# EAGLE design waveshaper (EAGLE 9.6.2)
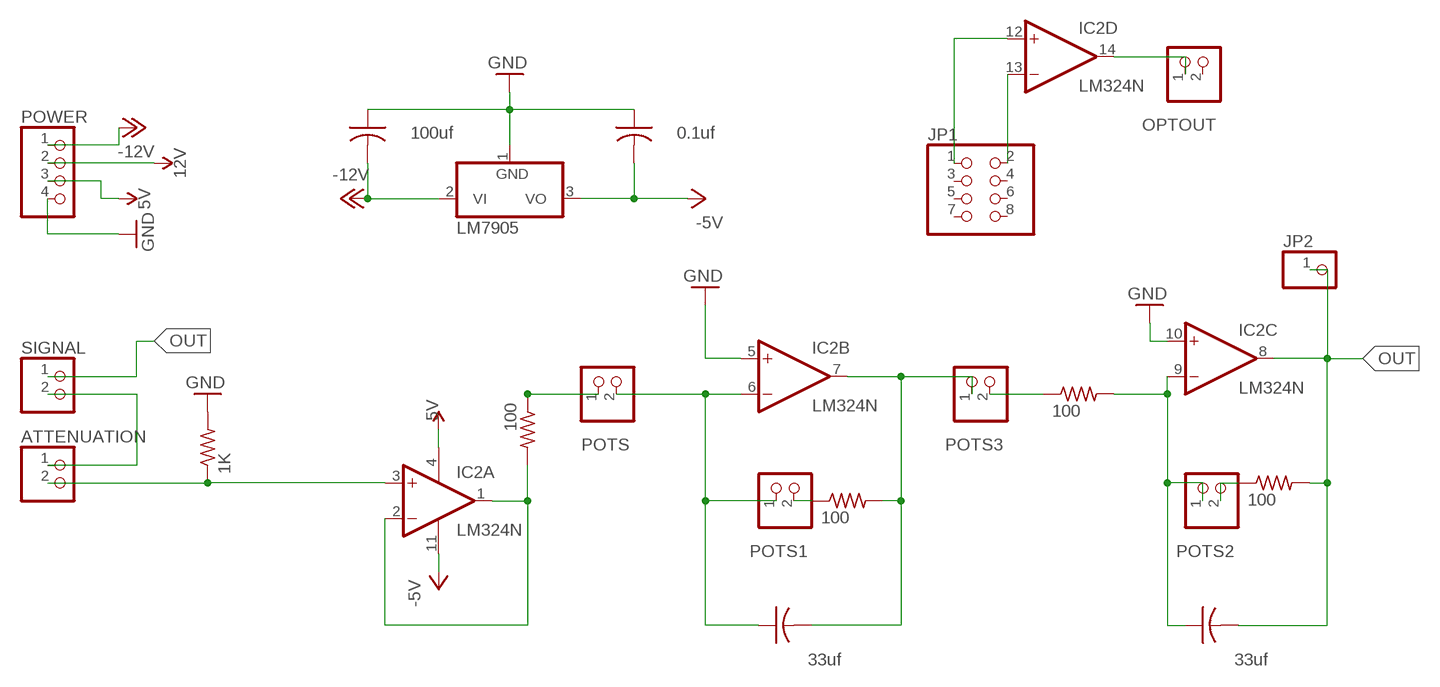
[diagram p0: schematic, sheet 1]

## Parts
ATTENUATION  PINHD-1X2  [1X02]
C1  100uf  C-US025-024X044  [C025-024X044]
C2  0.1uf  C-US025-024X044  [C025-024X044]
C3  33uf  C-US025-024X044  [C025-024X044]
C4  33uf  C-US025-024X044  [C025-024X044]
IC2  LM324N  [DIL14]
JP1  PINHD-2X4  [2X04]
JP2  PINHD-1X1  [1X01]
LM7905  7905T  [TO220H]
OPTOUT  PINHD-1X2  [1X02]
POTS  PINHD-1X2  [1X02]
POTS1  PINHD-1X2  [1X02]
POTS2  PINHD-1X2  [1X02]
POTS3  PINHD-1X2  [1X02]
POWER  PINHD-1X4  [1X04]
R1  1K  R-US_0207/12  [0207/12]
R2  100  R-US_0207/12  [0207/12]
R3  100  R-US_0207/12  [0207/12]
R4  100  R-US_0207/12  [0207/12]
R5  100  R-US_0207/12  [0207/12]
SIGNAL  PINHD-1X2  [1X02]

## Nets
5V: IC2.4(P:V+) POWER.3
12V: POWER.2
-5V: C2.2 IC2.11(P:V-) LM7905.3(VO)
-12V: C1.2 LM7905.2(VI) POWER.1
GND: C1.1 C2.1 IC2.5(B:+IN) IC2.10(C:+IN) LM7905.1(GND) POWER.4 R1.2
IN: ATTENUATION.2 IC2.3(A:+IN) R1.1
N$1: ATTENUATION.1 SIGNAL.2
N$2: C3.1 IC2.6(B:-IN) POTS1.1 POTS.2
N$3: C3.2 IC2.7(B:OUT) POTS3.1 R3.2
N$4: C4.1 IC2.9(C:-IN) POTS2.1 R5.2
N$5: IC2.14(D:OUT) OPTOUT.1
N$6: IC2.13(D:-IN) JP1.2
N$7: IC2.12(D:+IN) JP1.1
N$8: IC2.1(A:OUT) IC2.2(A:-IN) R2.2
N$9: POTS.1 R2.1
N$10: POTS1.2 R3.1
N$11: POTS2.2 R4.1
N$12: POTS3.2 R5.1
OUT: C4.2 IC2.8(C:OUT) JP2.1 R4.2 SIGNAL.1
Unconnected: JP1.3 JP1.4 JP1.5 JP1.6 JP1.7 JP1.8 OPTOUT.2

## Library data of the parts
ATTENUATION OPTOUT POTS POTS1-POTS3 SIGNAL = pinhead:PINHD-1X2: PIN HEADER
C1-C4 = adafruit:C-US: CAPACITOR, American symbol
IC2 = linear:LM324: OP AMP
JP1 = pinhead:PINHD-2X4: PIN HEADER
JP2 = pinhead:PINHD-1X1: PIN HEADER
LM7905 = linear:79*: Negative VOLTAGE REGULATOR
POWER = pinhead:PINHD-1X4: PIN HEADER
R1-R5 = adafruit:R-US_: RESISTOR, American symbol

## Board
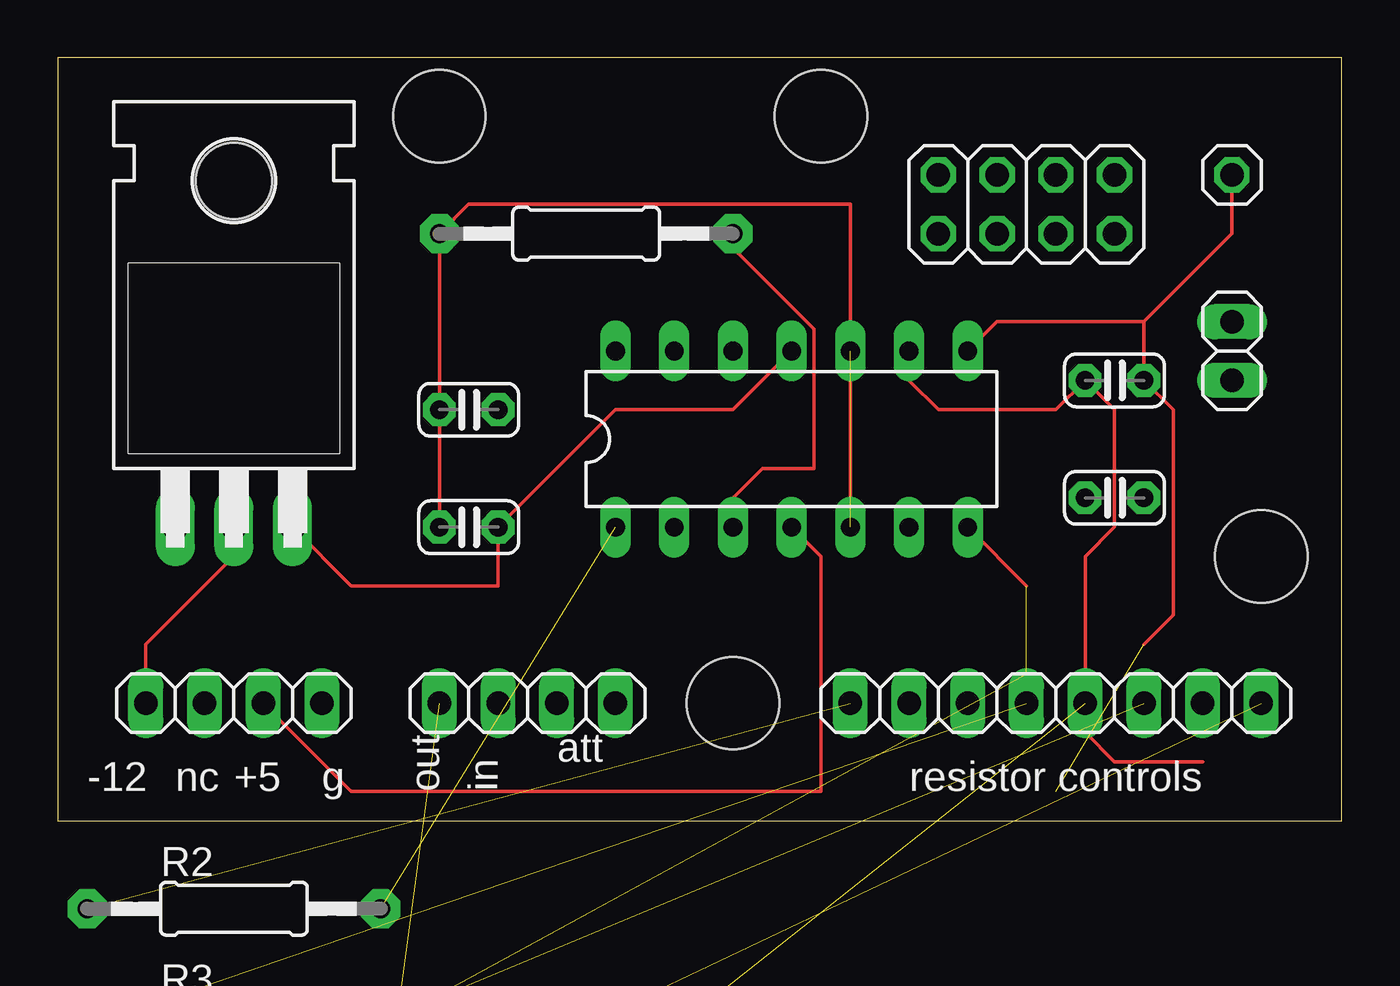
[diagram p1: board, top side]
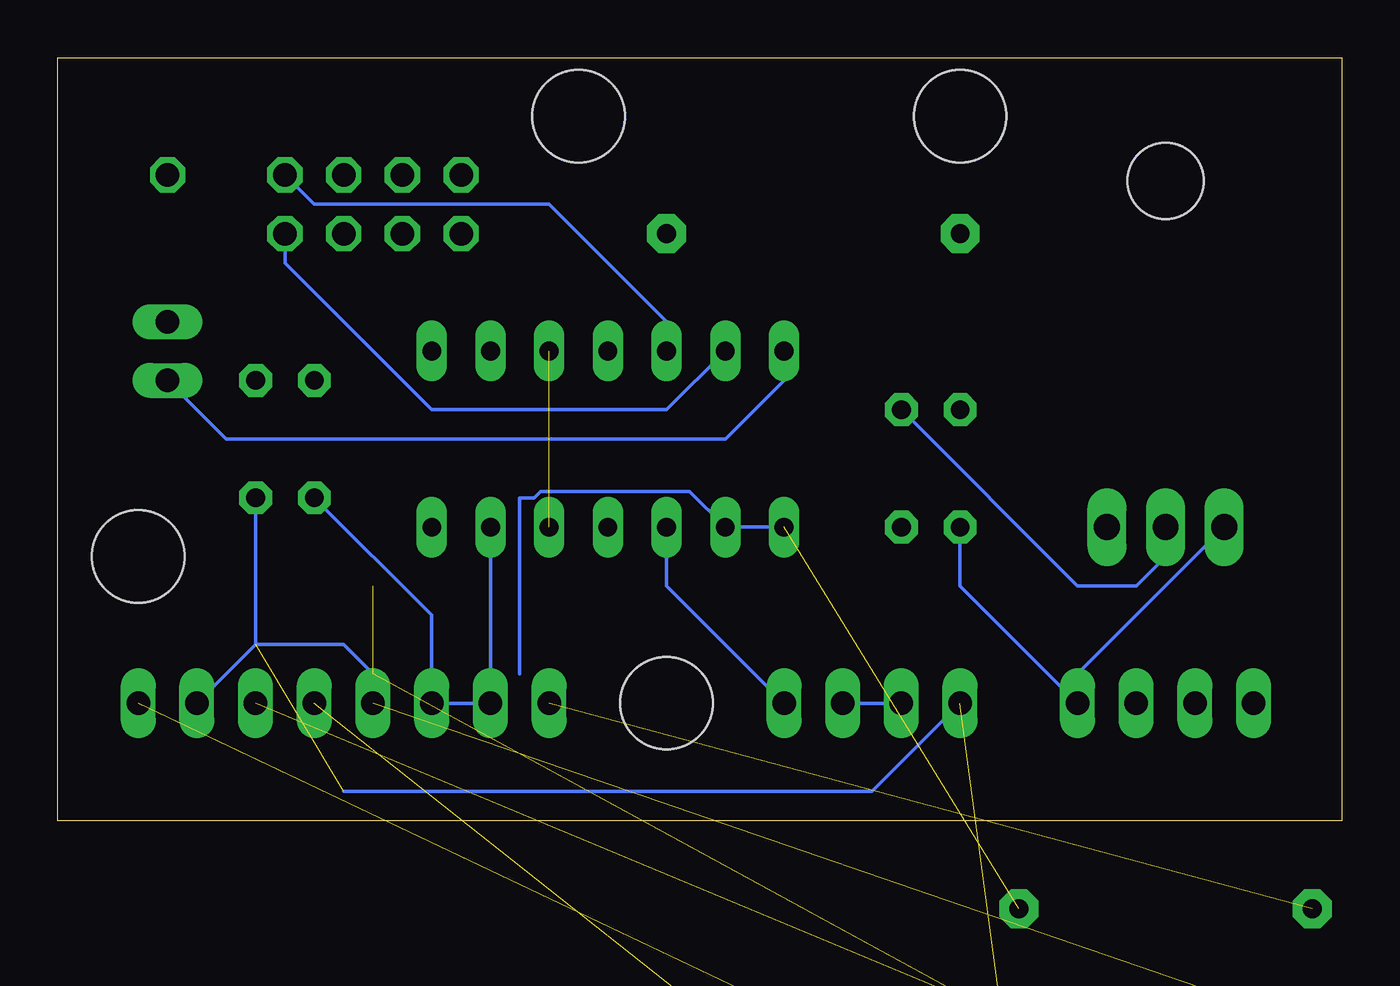
[diagram p2: board, bottom side, seen from below]

Size 55.55 x 33.01 mm. Coordinates in mm from the lower left corner, seen from the top.
Outline: 0,0 55.55,0 55.55,33.01 0,33.01 0,0
Copper layers (1*16): Top 0.035mm / dielectric 1.5mm / Bottom 0.035mm
Design rules "default": minimum track width 6mil, minimum drill 0.35mm, track to track 6mil, track to pad 6mil, pad to pad 6mil, via to via 6mil, smd to smd 6mil, copper to edge 40mil, drill to drill 6mil, minimum pad ring 10mil, minimum via ring 8mil, stop-mask expansion 4mil, vias tented up to drill 0mil, thermal gap 10mil
Holes 4 mm at 16.51,30.48 29.21,5.08 52.07,11.43 33.02,30.48

### Footprints (pad centres in the part's own frame; a part is rotated, then mirrored left to right if it is on the bottom)
1X02 = drill 1.016 long: 1 -1.27,0; 2 1.27,0
C025-024X044 = drill 0.813 pad 1.422 octagon: 1 -1.27,0; 2 1.27,0
DIL14 = drill 0.813 long: 1 -7.62,-3.81; 2 -5.08,-3.81; 3 -2.54,-3.81; 4 0,-3.81; 5 2.54,-3.81; 6 5.08,-3.81; 7 7.62,-3.81; 8 7.62,3.81; 9 5.08,3.81; 10 2.54,3.81; 11 0,3.81; 12 -2.54,3.81; 13 -5.08,3.81; 14 -7.62,3.81
2X04 = drill 1.016 octagon: 1 -3.81,-1.27; 2 -3.81,1.27; 3 -1.27,-1.27; 4 -1.27,1.27; 5 1.27,-1.27; 6 1.27,1.27; 7 3.81,-1.27; 8 3.81,1.27
1X01 = drill 1.016 octagon: 1 0,0
TO220H = drill 1.118 long: 1 -2.54,-10.16; 2 0,-10.16; 3 2.54,-10.16 | hole 3.302: 0,4.826
1X04 = drill 1.016 long: 1 -3.81,0; 2 -1.27,0; 3 1.27,0; 4 3.81,0
0207/12 = drill 0.813 pad 1.676 octagon: 1 -6.35,0; 2 6.35,0

### Placement (x,y rotation side)
ATTENUATION  22.86,5.08 0 top
C1  17.78,17.78 0 top
C2  17.78,12.7 0 top
C3  45.72,13.97 0 top
C4  45.72,19.05 0 top
IC2  31.75,16.51 0 top
JP1  41.91,26.67 180 top
JP2  50.8,27.94 0 top
LM7905  7.62,22.86 0 top
OPTOUT  50.8,20.32 90 top
POTS  35.56,5.08 0 top
POTS1  40.64,5.08 0 top
POTS2  45.72,5.08 0 top
POTS3  50.8,5.08 0 top
POWER  7.62,5.08 0 top
R1  22.86,25.4 180 top
R2  7.62,-3.81 0 top  (outside the outline)
R3  7.62,-8.89 0 top  (outside the outline)
R4  7.62,-13.97 0 top  (outside the outline)
R5  7.62,-19.05 0 top  (outside the outline)
SIGNAL  17.78,5.08 0 top

### Tracks (layer width: path | path; a pad name or v marks a point on that pad's centre or on a via)
5V
  Top 0.152: IC2.4 33.02,11.43 33.02,1.27 12.7,1.27 POWER.3
12V
  Top 0.152: POWER.2 6.35,3.81
-5V
  Top 0.152: LM7905.3 12.7,10.16 19.05,10.16 C2.2 24.13,17.78 26.67,17.78 29.21,17.78 IC2.11
-12V
  Top 0.152: LM7905.2 7.62,11.43 3.81,7.62 POWER.1
  Bottom 0.152: C1.2 11.43,10.16 8.89,10.16 7.62,11.43 LM7905.2
GND  (1 unrouted)
  Top 0.152: LM7905.1 5.08,13.97 | IC2.5 34.29,26.67 17.78,26.67 R1.2 C1.1 C2.1
  Bottom 0.152: C2.1 16.51,10.16 POWER.4 11.43,6.35 LM7905.1
IN
  Top 0.152: R1.1 29.21,24.78 32.72,21.27 32.72,15.24 30.48,15.24 29.21,13.97 IC2.3
  Bottom 0.152: IC2.3 29.21,10.16 ATTENUATION.2
N$1
  Bottom 0.152: SIGNAL.2 ATTENUATION.1
N$2
  Bottom 0.152: IC2.6 POTS.2 POTS1.1 39.37,8.89 C3.1
N$3  (2 unrouted)
  Top 0.152: IC2.7 41.91,10.16
  Bottom 0.152: POTS3.1 46.99,7.62 | 46.99,7.62 43.18,7.62 41.91,6.35 | C3.2 46.99,7.62
N$4  (1 unrouted)
  Top 0.152: IC2.9 36.83,19.05 38.1,17.78 43.18,17.78 C4.1 45.72,17.78 45.72,12.7 44.45,11.43 POTS2.1 44.45,3.81 45.72,2.54 49.53,2.54
N$5
  Bottom 0.152: OPTOUT.1 48.26,16.51 26.67,16.51 24.13,19.05 IC2.14
N$6
  Bottom 0.152: JP1.2 45.72,24.13 39.37,17.78 29.21,17.78 IC2.13
N$7
  Bottom 0.152: JP1.1 44.45,26.67 34.29,26.67 29.21,21.59 IC2.12
N$8  (1 unrouted)
  Bottom 0.152: IC2.1 IC2.2 28.22,14.25 34.66,14.25 34.94,13.97 35.56,13.97 35.56,6.35
N$9  (1 unrouted)
N$10  (1 unrouted)
N$11  (1 unrouted)
N$12  (1 unrouted)
OUT  (2 unrouted)
  Top 0.152: JP2.1 50.8,25.4 46.99,21.59 | 46.99,21.59 C4.2 48.26,17.78 48.26,8.89 46.99,7.62 | IC2.8 40.64,21.59 46.99,21.59
  Bottom 0.152: SIGNAL.1 20.32,1.27 43.18,1.27

### Text on the board
tPlace: att | -12 | nc | +5 | g | out | in | resistor controls